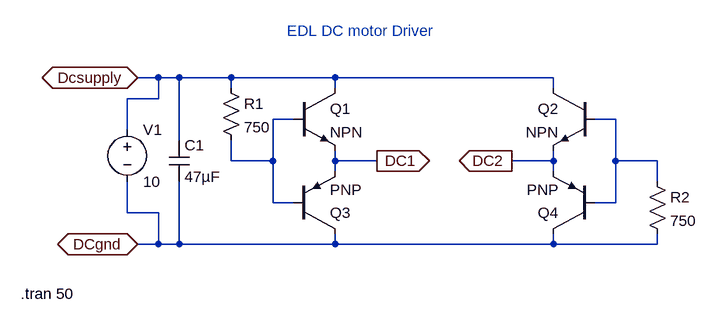
[diagram p0: schematic DC_motor_driver_test.asc]
DC_motor_driver_test.asc, the LTspice schematic file:
Version 4
SHEET 1 880 680
WIRE -144 0 -176 0
WIRE -112 0 -144 0
WIRE -32 0 -112 0
WIRE 128 0 -32 0
WIRE 464 0 128 0
WIRE -32 16 -32 0
WIRE 128 16 128 0
WIRE 464 16 464 0
WIRE -144 32 -144 0
WIRE -144 32 -192 32
WIRE 64 64 32 64
WIRE 560 64 528 64
WIRE -192 80 -192 32
WIRE -112 96 -112 0
WIRE -32 128 -32 96
WIRE 32 128 32 64
WIRE 32 128 -32 128
WIRE 128 128 128 112
WIRE 192 128 128 128
WIRE 464 128 464 112
WIRE 464 128 400 128
WIRE 560 128 560 64
WIRE 624 128 560 128
WIRE 128 144 128 128
WIRE 464 144 464 128
WIRE 624 160 624 128
WIRE 32 192 32 128
WIRE 64 192 32 192
WIRE 560 192 560 128
WIRE 560 192 528 192
WIRE -192 208 -192 160
WIRE -144 208 -192 208
WIRE -144 256 -144 208
WIRE -144 256 -176 256
WIRE -112 256 -112 160
WIRE -112 256 -144 256
WIRE 128 256 128 240
WIRE 128 256 -112 256
WIRE 464 256 464 240
WIRE 464 256 128 256
WIRE 624 256 624 240
WIRE 624 256 464 256
FLAG 400 128 DC2
IOPIN 400 128 Out
FLAG 192 128 DC1
IOPIN 192 128 Out
FLAG -176 256 DCgnd
IOPIN -176 256 BiDir
FLAG -176 0 Dcsupply
IOPIN -176 0 BiDir
SYMBOL npn 64 16 R0
SYMATTR InstName Q1
SYMBOL npn 528 16 M0
SYMATTR InstName Q2
SYMBOL pnp 64 240 M180
SYMATTR InstName Q3
SYMBOL pnp 528 240 R180
SYMATTR InstName Q4
SYMBOL cap -128 96 R0
SYMATTR InstName C1
SYMATTR Value 47µF
SYMBOL voltage -192 64 R0
SYMATTR InstName V1
SYMATTR Value 10
SYMBOL res -48 0 R0
SYMATTR InstName R1
SYMATTR Value 750
SYMBOL res 608 144 R0
SYMATTR InstName R2
SYMATTR Value 750
TEXT 168 -72 Center 2 ;EDL DC motor Driver
TEXT -356 332 Left 2 !.tran 50

The netlist it stands for:
* DC_motor_driver_test.asc
Q1 Dcsupply N001 DC1 0 NPN
Q2 Dcsupply N002 DC2 0 NPN
Q3 DCgnd N001 DC1 0 PNP
Q4 DCgnd N002 DC2 0 PNP
C1 Dcsupply DCgnd 47µF
V1 Dcsupply DCgnd 10
R1 Dcsupply N001 750
R2 N002 DCgnd 750
.model NPN NPN
.model PNP PNP
.lib standard.bjt
* EDL DC motor Driver
.tran 50
.backanno
.end